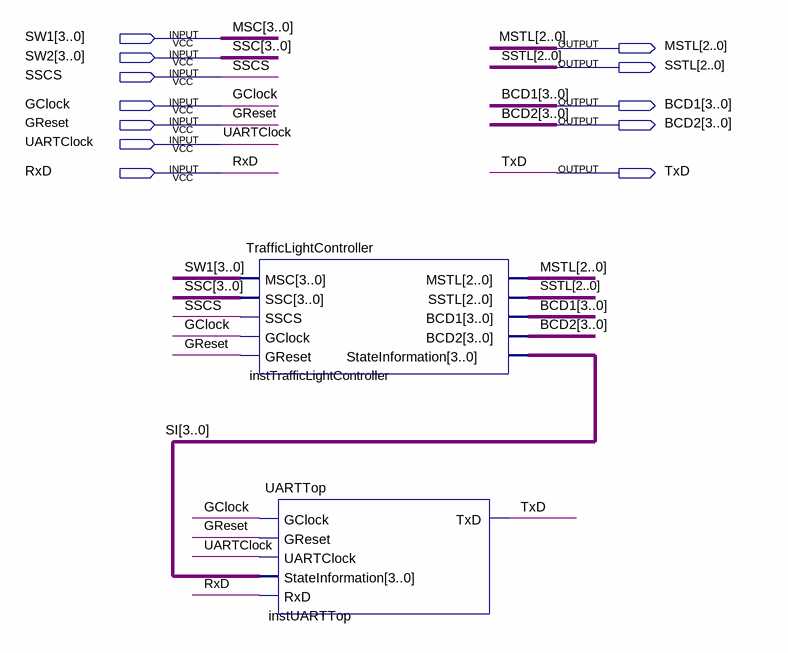
[diagram p0: schematic sheet]
// Quartus schematic TrafficLightControllerWithDebugMessages.bdf as structural Verilog: 2 symbols, 12 pins
module TrafficLightControllerWithDebugMessages (
  input  [3:0] SW1,
  input  [3:0] SW2,
  input  SSCS,
  input  GClock,
  input  GReset,
  input  UARTClock,
  input  RxD,
  output [2:0] MSTL,
  output [2:0] SSTL,
  output [3:0] BCD1,
  output [3:0] BCD2,
  output TxD
);

  wire [3:0] SI;

  TrafficLightController instTrafficLightController (
    .MSC(SW1), .SSC(SW2), .SSCS(SSCS), .GClock(GClock), .GReset(GReset), .MSTL(MSTL), .SSTL(SSTL),
    .BCD1(BCD1), .BCD2(BCD2), .StateInformation(SI));
  UARTTop instUARTTop (
    .GClock(GClock), .GReset(GReset), .UARTClock(UARTClock), .StateInformation(SI), .RxD(RxD), .TxD(TxD));

  // Other names for the same wires on the sheet: MSC[3:0] = SW1; SSC[3:0] = SW2
endmodule
